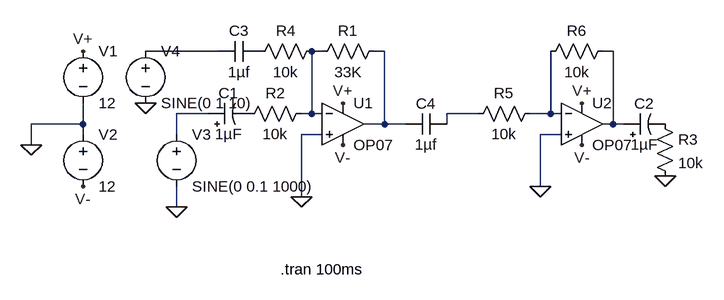
[diagram p0: schematic 003-opamp-mixer.asc]
003-opamp-mixer.asc, the LTspice schematic file:
Version 4
SHEET 1 944 680
WIRE 192 192 80 192
WIRE 352 192 336 192
WIRE 448 192 432 192
WIRE 800 192 784 192
WIRE 176 288 128 288
WIRE 336 288 336 192
WIRE 336 288 320 288
WIRE 352 288 336 288
WIRE 592 288 544 288
WIRE 704 288 704 192
WIRE 704 288 672 288
WIRE 720 288 704 288
WIRE -16 304 -16 272
WIRE -16 304 -96 304
WIRE 448 304 448 192
WIRE 448 304 416 304
WIRE 480 304 448 304
WIRE 544 304 544 288
WIRE 800 304 800 192
WIRE 800 304 784 304
WIRE 816 304 800 304
WIRE -16 320 -16 304
WIRE 128 320 128 288
WIRE 352 320 320 320
WIRE 720 320 688 320
WIRE -96 336 -96 304
WIRE 688 400 688 320
WIRE 320 416 320 320
WIRE 128 432 128 400
FLAG -96 336 0
FLAG 320 416 0
FLAG 128 432 0
FLAG 880 384 0
FLAG -16 192 V+
FLAG 384 272 V+
FLAG -16 400 V-
FLAG 384 336 V-
FLAG 80 272 0
FLAG 688 400 0
FLAG 752 272 V+
FLAG 752 336 V-
SYMBOL Opamps/OP07 384 240 R0
SYMATTR InstName U1
SYMBOL res 448 176 R90
WINDOW 0 0 56 VBottom 2
WINDOW 3 32 56 VTop 2
SYMATTR InstName R1
SYMATTR Value 33K
SYMBOL res 336 272 R90
WINDOW 0 0 56 VBottom 2
WINDOW 3 32 56 VTop 2
SYMATTR InstName R2
SYMATTR Value 10k
SYMBOL voltage -16 176 R0
SYMATTR InstName V1
SYMATTR Value 12
SYMBOL voltage -16 304 R0
SYMATTR InstName V2
SYMATTR Value 12
SYMBOL voltage 128 304 R0
SYMATTR InstName V3
SYMATTR Value SINE(0 0.1 1000)
SYMBOL polcap 176 304 R270
WINDOW 0 32 32 VTop 2
WINDOW 3 0 32 VBottom 2
SYMATTR InstName C1
SYMATTR Value 1µF
SYMBOL polcap 816 320 R270
WINDOW 0 32 32 VTop 2
WINDOW 3 0 32 VBottom 2
SYMATTR InstName C2
SYMATTR Value 1µF
SYMBOL res 864 288 R0
SYMATTR InstName R3
SYMATTR Value 10k
SYMBOL res 352 176 R90
WINDOW 0 0 56 VBottom 2
WINDOW 3 32 56 VTop 2
SYMATTR InstName R4
SYMATTR Value 10k
SYMBOL cap 256 176 R90
WINDOW 0 0 32 VBottom 2
WINDOW 3 32 32 VTop 2
SYMATTR InstName C3
SYMATTR Value 1µf
SYMBOL voltage 80 176 R0
SYMATTR InstName V4
SYMATTR Value SINE(0 1 10)
SYMBOL Opamps/OP07 752 240 R0
SYMATTR InstName U2
SYMBOL res 688 272 R90
WINDOW 0 0 56 VBottom 2
WINDOW 3 32 56 VTop 2
SYMATTR InstName R5
SYMATTR Value 10k
SYMBOL res 800 176 R90
WINDOW 0 0 56 VBottom 2
WINDOW 3 32 56 VTop 2
SYMATTR InstName R6
SYMATTR Value 10k
SYMBOL cap 544 288 R90
WINDOW 0 0 32 VBottom 2
WINDOW 3 32 32 VTop 2
SYMATTR InstName C4
SYMATTR Value 1µf
TEXT 288 528 Left 2 !.tran 100ms

The netlist it stands for:
* 003-opamp-mixer.asc
XU1 0 N002 V+ V- N003 LT1001  ; OP07, pins In+ In- V+ V- OUT
R1 N003 N002 33K
R2 N002 P001 10k
V1 V+ 0 12
V2 0 V- 12
V3 N005 0 SINE(0 0.1 1000)
C1 N005 P001 1µF
C2 N004 P002 1µF
R3 P002 0 10k
R4 N002 P003 10k
C3 P003 N001 1µf
V4 N001 0 SINE(0 1 10)
XU2 0 N007 V+ V- N004 LT1001  ; OP07, pins In+ In- V+ V- OUT
R5 N007 N006 10k
R6 N004 N007 10k
C4 N006 N003 1µf
.tran 100ms
.lib LTC.lib
.backanno
.end